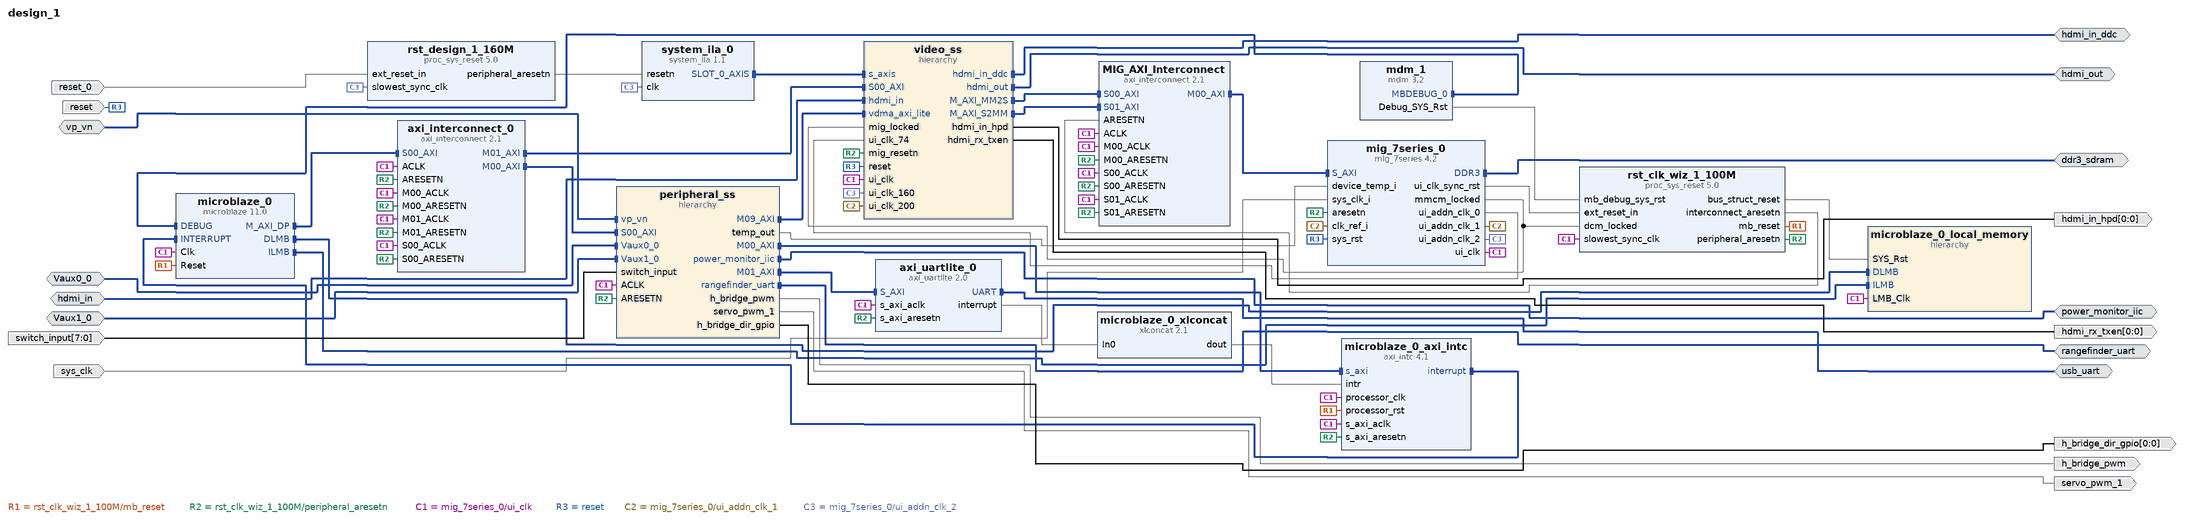
[diagram p0: block diagram of the top level]
# Vivado block design design_1, xc7a200tsbg484-1, Vivado 2018.3
create_bd_design design_1

create_bd_intf_port -mode Master -vlnv xilinx.com:interface:uart_rtl:1.0 usb_uart
create_bd_intf_port -mode Master -vlnv xilinx.com:interface:iic_rtl:1.0 power_monitor_iic
create_bd_intf_port -mode Master -vlnv xilinx.com:interface:uart_rtl:1.0 rangefinder_uart
create_bd_intf_port -mode Slave -vlnv digilentinc.com:interface:tmds_rtl:1.0 hdmi_in
create_bd_intf_port -mode Master -vlnv xilinx.com:interface:iic_rtl:1.0 hdmi_in_ddc
create_bd_intf_port -mode Master -vlnv digilentinc.com:interface:tmds_rtl:1.0 hdmi_out
create_bd_intf_port -mode Slave -vlnv xilinx.com:interface:diff_analog_io_rtl:1.0 vp_vn
create_bd_intf_port -mode Slave -vlnv xilinx.com:interface:diff_analog_io_rtl:1.0 Vaux0_0
create_bd_intf_port -mode Slave -vlnv xilinx.com:interface:diff_analog_io_rtl:1.0 Vaux1_0
create_bd_intf_port -mode Master -vlnv xilinx.com:interface:ddrx_rtl:1.0 ddr3_sdram
create_bd_port -dir O h_bridge_pwm
create_bd_port -dir O servo_pwm_1
create_bd_port -dir O -from 0 -to 0 h_bridge_dir_gpio
create_bd_port -dir I -from 7 -to 0 switch_input
create_bd_port -dir O -from 0 -to 0 hdmi_in_hpd
create_bd_port -dir O -from 0 -to 0 hdmi_rx_txen
create_bd_port -dir I -type rst reset
set_property -dict {CONFIG.POLARITY ACTIVE_LOW} [get_bd_ports reset]
create_bd_port -dir I -type clk sys_clk
create_bd_port -dir I -type rst reset_0
set_property -dict {CONFIG.POLARITY ACTIVE_LOW} [get_bd_ports reset_0]

create_bd_cell -type ip -vlnv xilinx.com:ip:microblaze:11.0 microblaze_0
set_property -dict {CONFIG.C_DEBUG_ENABLED 1 CONFIG.C_D_AXI 1 CONFIG.C_D_LMB 1 CONFIG.C_I_LMB 1} [get_bd_cells microblaze_0]
create_bd_cell -type hier microblaze_0_local_memory
create_bd_cell -type ip -vlnv xilinx.com:ip:axi_intc:4.1 microblaze_0_axi_intc
set_property -dict {CONFIG.C_HAS_FAST 1} [get_bd_cells microblaze_0_axi_intc]
create_bd_cell -type ip -vlnv xilinx.com:ip:xlconcat:2.1 microblaze_0_xlconcat
set_property -dict {CONFIG.NUM_PORTS 1} [get_bd_cells microblaze_0_xlconcat]
create_bd_cell -type ip -vlnv xilinx.com:ip:mdm:3.2 mdm_1
create_bd_cell -type ip -vlnv xilinx.com:ip:proc_sys_reset:5.0 rst_clk_wiz_1_100M
set_property -dict {CONFIG.RESET_BOARD_INTERFACE Custom CONFIG.USE_BOARD_FLOW true} [get_bd_cells rst_clk_wiz_1_100M]
create_bd_cell -type ip -vlnv xilinx.com:ip:axi_uartlite:2.0 axi_uartlite_0
set_property -dict {CONFIG.UARTLITE_BOARD_INTERFACE usb_uart CONFIG.USE_BOARD_FLOW true} [get_bd_cells axi_uartlite_0]
create_bd_cell -type hier video_ss
create_bd_cell -type hier peripheral_ss
create_bd_cell -type ip -vlnv xilinx.com:ip:axi_interconnect:2.1 MIG_AXI_Interconnect
set_property -dict {CONFIG.NUM_MI 1 CONFIG.NUM_SI 2} [get_bd_cells MIG_AXI_Interconnect]
create_bd_cell -type ip -vlnv xilinx.com:ip:mig_7series:4.2 mig_7series_0
set_property -dict [list \
  CONFIG.BOARD_MIG_PARAM ddr3_sdram \
  CONFIG.MIG_DONT_TOUCH_PARAM Custom \
  CONFIG.RESET_BOARD_INTERFACE Custom \
  CONFIG.XML_INPUT_FILE mig_a.prj \
] [get_bd_cells mig_7series_0]
create_bd_cell -type ip -vlnv xilinx.com:ip:axi_interconnect:2.1 axi_interconnect_0
create_bd_cell -type ip -vlnv xilinx.com:ip:system_ila:1.1 system_ila_0
set_property -dict [list \
  CONFIG.C_MON_TYPE INTERFACE \
  CONFIG.C_NUM_MONITOR_SLOTS 1 \
  CONFIG.C_SLOT_0_APC_EN 0 \
  CONFIG.C_SLOT_0_AXI_DATA_SEL 1 \
  CONFIG.C_SLOT_0_AXI_TRIG_SEL 1 \
  CONFIG.C_SLOT_0_INTF_TYPE xilinx.com:interface:axis_rtl:1.0 \
] [get_bd_cells system_ila_0]
create_bd_cell -type ip -vlnv xilinx.com:ip:proc_sys_reset:5.0 rst_design_1_160M
set_property -dict {CONFIG.RESET_BOARD_INTERFACE reset CONFIG.USE_BOARD_FLOW true} [get_bd_cells rst_design_1_160M]

# ---- hierarchy /microblaze_0_local_memory ----
current_bd_instance /microblaze_0_local_memory
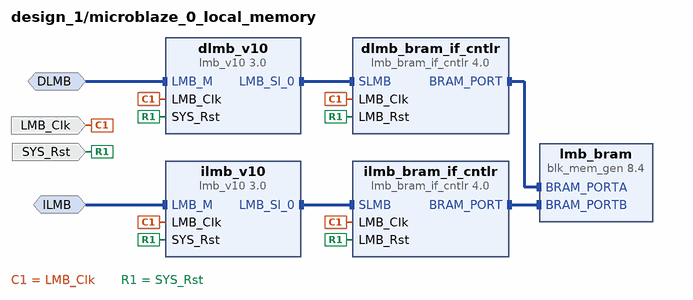
[diagram p1: block diagram inside /microblaze_0_local_memory]
create_bd_intf_pin -mode MirroredMaster -vlnv xilinx.com:interface:lmb_rtl:1.0 DLMB
create_bd_intf_pin -mode MirroredMaster -vlnv xilinx.com:interface:lmb_rtl:1.0 ILMB
create_bd_pin -dir I -type clk LMB_Clk
create_bd_pin -dir I -type rst SYS_Rst

create_bd_cell -type ip -vlnv xilinx.com:ip:lmb_v10:3.0 dlmb_v10
create_bd_cell -type ip -vlnv xilinx.com:ip:lmb_v10:3.0 ilmb_v10
create_bd_cell -type ip -vlnv xilinx.com:ip:lmb_bram_if_cntlr:4.0 dlmb_bram_if_cntlr
set_property -dict {CONFIG.C_ECC 0} [get_bd_cells dlmb_bram_if_cntlr]
create_bd_cell -type ip -vlnv xilinx.com:ip:lmb_bram_if_cntlr:4.0 ilmb_bram_if_cntlr
set_property -dict {CONFIG.C_ECC 0} [get_bd_cells ilmb_bram_if_cntlr]
create_bd_cell -type ip -vlnv xilinx.com:ip:blk_mem_gen:8.4 lmb_bram
set_property -dict {CONFIG.Memory_Type True_Dual_Port_RAM CONFIG.use_bram_block BRAM_Controller} [get_bd_cells lmb_bram]

# ---- hierarchy /video_ss ----
current_bd_instance /video_ss
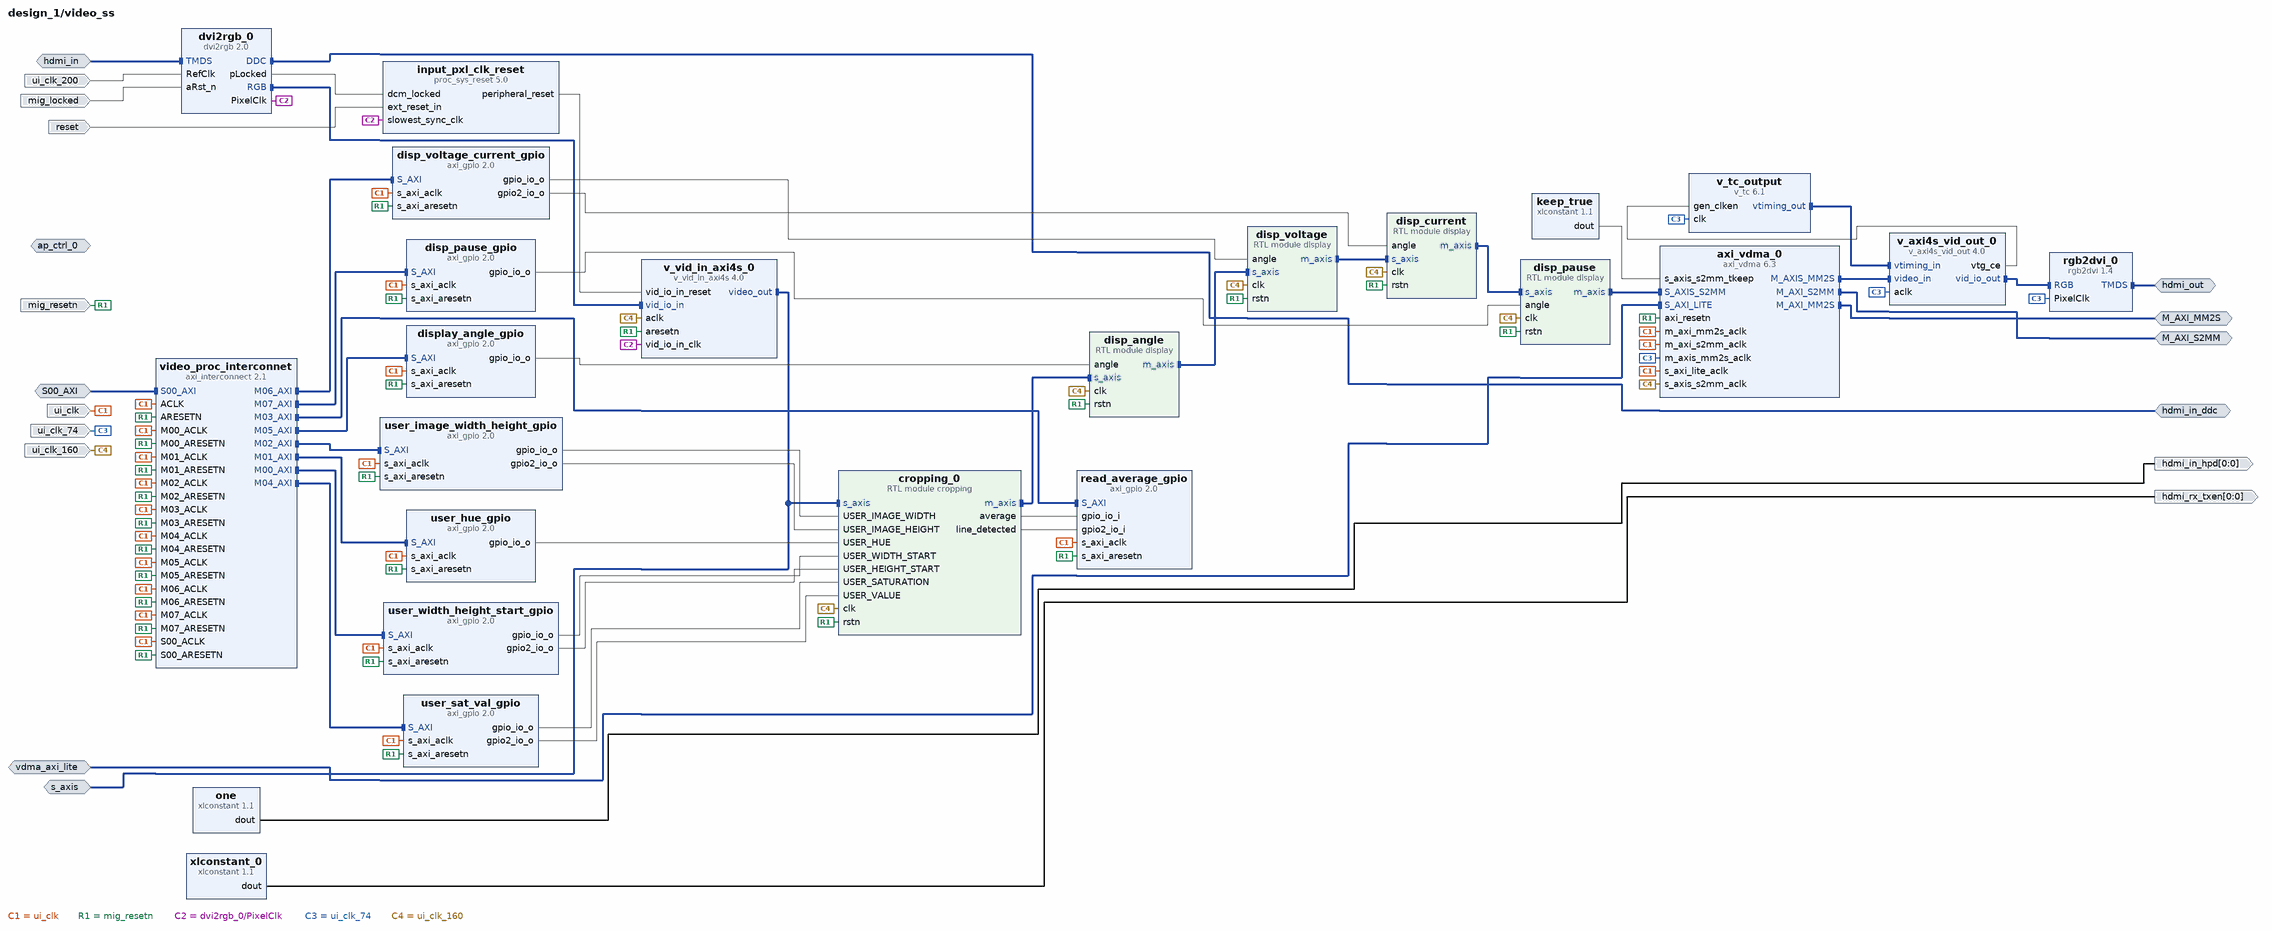
[diagram p2: block diagram inside /video_ss]
create_bd_intf_pin -mode Slave -vlnv digilentinc.com:interface:tmds_rtl:1.0 hdmi_in
create_bd_intf_pin -mode Master -vlnv xilinx.com:interface:iic_rtl:1.0 hdmi_in_ddc
create_bd_intf_pin -mode Master -vlnv digilentinc.com:interface:tmds_rtl:1.0 hdmi_out
create_bd_intf_pin -mode Slave -vlnv xilinx.com:interface:aximm_rtl:1.0 vdma_axi_lite
create_bd_intf_pin -mode Master -vlnv xilinx.com:interface:aximm_rtl:1.0 M_AXI_MM2S
create_bd_intf_pin -mode Master -vlnv xilinx.com:interface:aximm_rtl:1.0 M_AXI_S2MM
create_bd_intf_pin -mode Slave -vlnv xilinx.com:interface:acc_handshake_rtl:1.0 ap_ctrl_0
create_bd_intf_pin -mode Slave -vlnv xilinx.com:interface:aximm_rtl:1.0 S00_AXI
create_bd_intf_pin -mode Monitor -vlnv xilinx.com:interface:axis_rtl:1.0 s_axis
create_bd_pin -dir I -type clk ui_clk_200
create_bd_pin -dir I -type clk ui_clk
create_bd_pin -dir I -type rst mig_resetn
create_bd_pin -dir O -from 0 -to 0 hdmi_in_hpd
create_bd_pin -dir O -from 0 -to 0 hdmi_rx_txen
create_bd_pin -dir I -type clk ui_clk_160
create_bd_pin -dir I -type rst mig_locked
create_bd_pin -dir I -type rst reset
create_bd_pin -dir I -type clk ui_clk_74

create_bd_cell -type ip -vlnv xilinx.com:ip:v_vid_in_axi4s:4.0 v_vid_in_axi4s_0
set_property -dict {CONFIG.C_HAS_ASYNC_CLK 1} [get_bd_cells v_vid_in_axi4s_0]
create_bd_cell -type ip -vlnv digilentinc.com:ip:rgb2dvi:1.4 rgb2dvi_0
set_property -dict {CONFIG.kClkRange 3 CONFIG.kRstActiveHigh false} [get_bd_cells rgb2dvi_0]
create_bd_cell -type ip -vlnv xilinx.com:ip:v_axi4s_vid_out:4.0 v_axi4s_vid_out_0
set_property -dict {CONFIG.C_HAS_ASYNC_CLK 0 CONFIG.C_VTG_MASTER_SLAVE 0} [get_bd_cells v_axi4s_vid_out_0]
create_bd_cell -type ip -vlnv xilinx.com:ip:axi_vdma:6.3 axi_vdma_0
set_property -dict [list \
  CONFIG.c_include_mm2s_dre 1 \
  CONFIG.c_include_s2mm_dre 1 \
  CONFIG.c_m_axis_mm2s_tdata_width 24 \
  CONFIG.c_num_fstores 1 \
] [get_bd_cells axi_vdma_0]
create_bd_cell -type ip -vlnv xilinx.com:ip:xlconstant:1.1 one
create_bd_cell -type ip -vlnv xilinx.com:ip:xlconstant:1.1 xlconstant_0
create_bd_cell -type ip -vlnv xilinx.com:ip:proc_sys_reset:5.0 input_pxl_clk_reset
set_property -dict {CONFIG.RESET_BOARD_INTERFACE reset CONFIG.USE_BOARD_FLOW true} [get_bd_cells input_pxl_clk_reset]
create_bd_cell -type ip -vlnv xilinx.com:ip:v_tc:6.1 v_tc_output
set_property -dict {CONFIG.HAS_AXI4_LITE false CONFIG.VIDEO_MODE 720p CONFIG.enable_detection false} [get_bd_cells v_tc_output]
create_bd_cell -type ip -vlnv xilinx.com:ip:xlconstant:1.1 keep_true
set_property -dict {CONFIG.CONST_VAL 7 CONFIG.CONST_WIDTH 3} [get_bd_cells keep_true]
create_bd_cell -type ip -vlnv xilinx.com:ip:axi_gpio:2.0 user_image_width_height_gpio
set_property -dict [list \
  CONFIG.C_ALL_OUTPUTS 1 \
  CONFIG.C_ALL_OUTPUTS_2 1 \
  CONFIG.C_DOUT_DEFAULT 0x0000005A \
  CONFIG.C_DOUT_DEFAULT_2 0x0000005A \
  CONFIG.C_IS_DUAL 1 \
] [get_bd_cells user_image_width_height_gpio]
create_bd_cell -type ip -vlnv xilinx.com:ip:axi_gpio:2.0 user_width_height_start_gpio
set_property -dict [list \
  CONFIG.C_ALL_OUTPUTS 1 \
  CONFIG.C_ALL_OUTPUTS_2 1 \
  CONFIG.C_DOUT_DEFAULT 0x0000049C \
  CONFIG.C_DOUT_DEFAULT_2 0x0000026C \
  CONFIG.C_IS_DUAL 1 \
] [get_bd_cells user_width_height_start_gpio]
create_bd_cell -type ip -vlnv xilinx.com:ip:axi_gpio:2.0 user_hue_gpio
set_property -dict {CONFIG.C_ALL_OUTPUTS 1 CONFIG.C_DOUT_DEFAULT 0x00000014 CONFIG.C_GPIO_WIDTH 9} [get_bd_cells user_hue_gpio]
create_bd_cell -type ip -vlnv xilinx.com:ip:axi_gpio:2.0 read_average_gpio
set_property -dict [list \
  CONFIG.C_ALL_INPUTS 1 \
  CONFIG.C_ALL_INPUTS_2 1 \
  CONFIG.C_GPIO2_WIDTH 1 \
  CONFIG.C_GPIO_WIDTH 24 \
  CONFIG.C_IS_DUAL 1 \
] [get_bd_cells read_average_gpio]
create_bd_cell -type ip -vlnv xilinx.com:ip:axi_interconnect:2.1 video_proc_interconnet
set_property -dict {CONFIG.NUM_MI 8} [get_bd_cells video_proc_interconnet]
create_bd_cell -type ip -vlnv digilentinc.com:ip:dvi2rgb:2.0 dvi2rgb_0
set_property -dict [list \
  CONFIG.kAddBUFG false \
  CONFIG.kClkRange 3 \
  CONFIG.kEdidFileName dgl_720p_cea.data \
  CONFIG.kRstActiveHigh false \
] [get_bd_cells dvi2rgb_0]
create_bd_cell -type ip -vlnv xilinx.com:ip:axi_gpio:2.0 user_sat_val_gpio
set_property -dict [list \
  CONFIG.C_ALL_OUTPUTS 1 \
  CONFIG.C_ALL_OUTPUTS_2 1 \
  CONFIG.C_DOUT_DEFAULT 0x00000032 \
  CONFIG.C_DOUT_DEFAULT_2 0x00000032 \
  CONFIG.C_GPIO2_WIDTH 8 \
  CONFIG.C_GPIO_WIDTH 8 \
  CONFIG.C_IS_DUAL 1 \
] [get_bd_cells user_sat_val_gpio]
create_bd_cell -type ip -vlnv xilinx.com:ip:axi_gpio:2.0 display_angle_gpio
set_property -dict {CONFIG.C_ALL_OUTPUTS 1 CONFIG.C_GPIO_WIDTH 32} [get_bd_cells display_angle_gpio]
create_bd_cell -type ip -vlnv xilinx.com:ip:axi_gpio:2.0 disp_voltage_current_gpio
set_property -dict {CONFIG.C_ALL_OUTPUTS 1 CONFIG.C_ALL_OUTPUTS_2 1 CONFIG.C_IS_DUAL 1} [get_bd_cells disp_voltage_current_gpio]
create_bd_cell -type ip -vlnv xilinx.com:ip:axi_gpio:2.0 disp_pause_gpio
set_property -dict {CONFIG.C_ALL_INPUTS 0 CONFIG.C_ALL_OUTPUTS 1} [get_bd_cells disp_pause_gpio]
create_bd_cell -type module -reference cropping cropping_0
set_property -dict {CONFIG.IMAGE_HEIGHT 720 CONFIG.IMAGE_WIDTH 1280} [get_bd_cells cropping_0]
create_bd_cell -type module -reference display disp_current
set_property -dict {CONFIG.START_HEIGHT 128 CONFIG.START_WIDTH 0 CONFIG.UNIT current} [get_bd_cells disp_current]
create_bd_cell -type module -reference display disp_voltage
set_property -dict {CONFIG.START_HEIGHT 0 CONFIG.START_WIDTH 0 CONFIG.UNIT voltage} [get_bd_cells disp_voltage]
create_bd_cell -type module -reference display disp_pause
set_property -dict {CONFIG.START_HEIGHT 128 CONFIG.START_WIDTH 6 CONFIG.UNIT stopgo} [get_bd_cells disp_pause]
create_bd_cell -type module -reference display disp_angle
set_property -dict {CONFIG.START_HEIGHT 0 CONFIG.START_WIDTH 6} [get_bd_cells disp_angle]

# ---- hierarchy /peripheral_ss ----
current_bd_instance /peripheral_ss
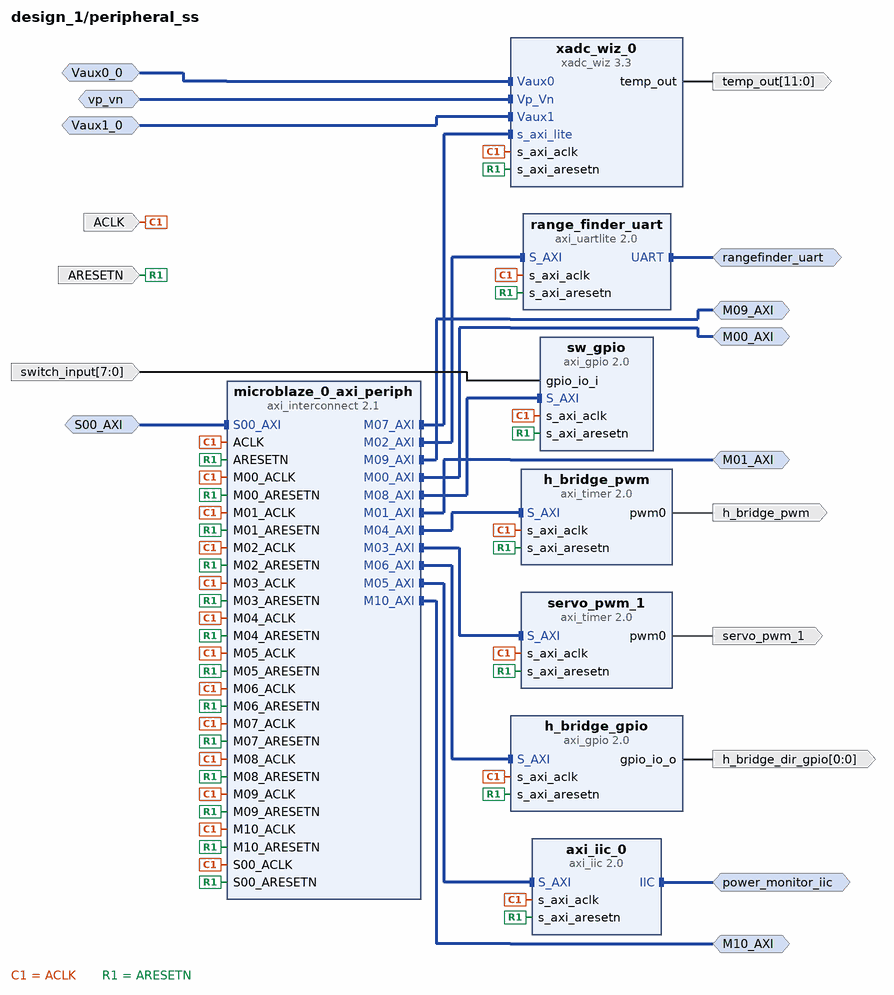
[diagram p3: block diagram inside /peripheral_ss]
create_bd_intf_pin -mode Master -vlnv xilinx.com:interface:iic_rtl:1.0 power_monitor_iic
create_bd_intf_pin -mode Master -vlnv xilinx.com:interface:uart_rtl:1.0 rangefinder_uart
create_bd_intf_pin -mode Slave -vlnv xilinx.com:interface:aximm_rtl:1.0 S00_AXI
create_bd_intf_pin -mode Master -vlnv xilinx.com:interface:aximm_rtl:1.0 M00_AXI
create_bd_intf_pin -mode Master -vlnv xilinx.com:interface:aximm_rtl:1.0 M01_AXI
create_bd_intf_pin -mode Master -vlnv xilinx.com:interface:aximm_rtl:1.0 M09_AXI
create_bd_intf_pin -mode Master -vlnv xilinx.com:interface:aximm_rtl:1.0 M10_AXI
create_bd_intf_pin -mode Slave -vlnv xilinx.com:interface:diff_analog_io_rtl:1.0 vp_vn
create_bd_intf_pin -mode Slave -vlnv xilinx.com:interface:diff_analog_io_rtl:1.0 Vaux0_0
create_bd_intf_pin -mode Slave -vlnv xilinx.com:interface:diff_analog_io_rtl:1.0 Vaux1_0
create_bd_pin -dir O servo_pwm_1
create_bd_pin -dir I -type clk ACLK
create_bd_pin -dir I -type rst ARESETN
create_bd_pin -dir O -from 0 -to 0 h_bridge_dir_gpio
create_bd_pin -dir I -from 7 -to 0 switch_input
create_bd_pin -dir O h_bridge_pwm
create_bd_pin -dir O -from 11 -to 0 temp_out

create_bd_cell -type ip -vlnv xilinx.com:ip:axi_timer:2.0 servo_pwm_1
create_bd_cell -type ip -vlnv xilinx.com:ip:axi_iic:2.0 axi_iic_0
create_bd_cell -type ip -vlnv xilinx.com:ip:axi_gpio:2.0 h_bridge_gpio
set_property -dict {CONFIG.C_ALL_INPUTS 0 CONFIG.C_ALL_OUTPUTS 1 CONFIG.C_GPIO_WIDTH 1} [get_bd_cells h_bridge_gpio]
create_bd_cell -type ip -vlnv xilinx.com:ip:axi_gpio:2.0 sw_gpio
set_property -dict [list \
  CONFIG.C_ALL_INPUTS 1 \
  CONFIG.C_GPIO_WIDTH 8 \
  CONFIG.C_IS_DUAL 0 \
  CONFIG.GPIO_BOARD_INTERFACE Custom \
] [get_bd_cells sw_gpio]
create_bd_cell -type ip -vlnv xilinx.com:ip:axi_uartlite:2.0 range_finder_uart
create_bd_cell -type ip -vlnv xilinx.com:ip:axi_timer:2.0 h_bridge_pwm
create_bd_cell -type ip -vlnv xilinx.com:ip:axi_interconnect:2.1 microblaze_0_axi_periph
set_property -dict {CONFIG.NUM_MI 11} [get_bd_cells microblaze_0_axi_periph]
create_bd_cell -type ip -vlnv xilinx.com:ip:xadc_wiz:3.3 xadc_wiz_0
set_property -dict [list \
  CONFIG.AVERAGE_ENABLE_TEMPERATURE true \
  CONFIG.CHANNEL_AVERAGING 16 \
  CONFIG.CHANNEL_ENABLE_CALIBRATION false \
  CONFIG.CHANNEL_ENABLE_TEMPERATURE true \
  CONFIG.CHANNEL_ENABLE_VAUXP0_VAUXN0 true \
  CONFIG.CHANNEL_ENABLE_VAUXP1_VAUXN1 true \
  CONFIG.CHANNEL_ENABLE_VP_VN true \
  CONFIG.ENABLE_RESET false \
  CONFIG.ENABLE_TEMP_BUS true \
  CONFIG.EXTERNAL_MUX_CHANNEL VP_VN \
  CONFIG.INTERFACE_SELECTION Enable_AXI \
  CONFIG.OT_ALARM false \
  CONFIG.SEQUENCER_MODE Continuous \
  CONFIG.SINGLE_CHANNEL_SELECTION TEMPERATURE \
  CONFIG.USER_TEMP_ALARM false \
  CONFIG.VCCAUX_ALARM false \
  CONFIG.VCCINT_ALARM false \
  CONFIG.XADC_STARUP_SELECTION channel_sequencer \
] [get_bd_cells xadc_wiz_0]

# ---- connections ----

current_bd_instance /microblaze_0_local_memory
connect_bd_intf_net -intf_net microblaze_0_dlmb [get_bd_intf_pins DLMB] [get_bd_intf_pins dlmb_v10/LMB_M]
connect_bd_intf_net -intf_net microblaze_0_ilmb_cntlr [get_bd_intf_pins ilmb_bram_if_cntlr/BRAM_PORT] [get_bd_intf_pins lmb_bram/BRAM_PORTB]
connect_bd_intf_net -intf_net microblaze_0_ilmb_bus [get_bd_intf_pins ilmb_v10/LMB_Sl_0] [get_bd_intf_pins ilmb_bram_if_cntlr/SLMB]
connect_bd_intf_net -intf_net microblaze_0_dlmb_bus [get_bd_intf_pins dlmb_v10/LMB_Sl_0] [get_bd_intf_pins dlmb_bram_if_cntlr/SLMB]
connect_bd_intf_net -intf_net microblaze_0_dlmb_cntlr [get_bd_intf_pins dlmb_bram_if_cntlr/BRAM_PORT] [get_bd_intf_pins lmb_bram/BRAM_PORTA]
connect_bd_intf_net -intf_net microblaze_0_ilmb [get_bd_intf_pins ILMB] [get_bd_intf_pins ilmb_v10/LMB_M]
connect_bd_net -net microblaze_0_Clk [get_bd_pins LMB_Clk] \
  [get_bd_pins dlmb_v10/LMB_Clk] [get_bd_pins dlmb_bram_if_cntlr/LMB_Clk] [get_bd_pins ilmb_v10/LMB_Clk] \
  [get_bd_pins ilmb_bram_if_cntlr/LMB_Clk]
connect_bd_net [get_bd_pins SYS_Rst] \
  [get_bd_pins dlmb_v10/SYS_Rst] [get_bd_pins dlmb_bram_if_cntlr/LMB_Rst] [get_bd_pins ilmb_v10/SYS_Rst] \
  [get_bd_pins ilmb_bram_if_cntlr/LMB_Rst]
set_property HDL_ATTRIBUTE.BMM_INFO_ADDRESS_SPACE {byte  0x00000000 32 > design_1 microblaze_0_local_memory/lmb_bram} [get_bd_cells dlmb_bram_if_cntlr]
set_property HDL_ATTRIBUTE.KEEP_HIERARCHY yes [get_bd_cells dlmb_bram_if_cntlr]

current_bd_instance /video_ss
connect_bd_intf_net [get_bd_intf_pins M_AXI_S2MM] [get_bd_intf_pins axi_vdma_0/M_AXI_S2MM]
connect_bd_intf_net [get_bd_intf_pins S00_AXI] [get_bd_intf_pins video_proc_interconnet/S00_AXI]
connect_bd_intf_net [get_bd_intf_pins M_AXI_MM2S] [get_bd_intf_pins axi_vdma_0/M_AXI_MM2S]
connect_bd_intf_net [get_bd_intf_pins hdmi_in_ddc] [get_bd_intf_pins dvi2rgb_0/DDC]
connect_bd_intf_net [get_bd_intf_pins v_axi4s_vid_out_0/vid_io_out] [get_bd_intf_pins rgb2dvi_0/RGB]
connect_bd_intf_net [get_bd_intf_pins vdma_axi_lite] [get_bd_intf_pins axi_vdma_0/S_AXI_LITE]
connect_bd_intf_net [get_bd_intf_pins v_tc_output/vtiming_out] [get_bd_intf_pins v_axi4s_vid_out_0/vtiming_in]
connect_bd_intf_net [get_bd_intf_pins axi_vdma_0/M_AXIS_MM2S] [get_bd_intf_pins v_axi4s_vid_out_0/video_in]
connect_bd_intf_net [get_bd_intf_pins hdmi_out] [get_bd_intf_pins rgb2dvi_0/TMDS]
connect_bd_intf_net [get_bd_intf_pins user_width_height_start_gpio/S_AXI] [get_bd_intf_pins video_proc_interconnet/M00_AXI]
connect_bd_intf_net [get_bd_intf_pins user_image_width_height_gpio/S_AXI] [get_bd_intf_pins video_proc_interconnet/M02_AXI]
connect_bd_intf_net [get_bd_intf_pins v_vid_in_axi4s_0/vid_io_in] [get_bd_intf_pins dvi2rgb_0/RGB]
connect_bd_intf_net [get_bd_intf_pins disp_angle/m_axis] [get_bd_intf_pins disp_voltage/s_axis]
connect_bd_intf_net [get_bd_intf_pins disp_pause_gpio/S_AXI] [get_bd_intf_pins video_proc_interconnet/M07_AXI]
connect_bd_intf_net -intf_net v_vid_in_axi4s_0_video_out [get_bd_intf_pins cropping_0/s_axis] [get_bd_intf_pins v_vid_in_axi4s_0/video_out]
connect_bd_intf_net [get_bd_intf_pins cropping_0/s_axis] [get_bd_intf_pins s_axis]
connect_bd_intf_net [get_bd_intf_pins disp_voltage/m_axis] [get_bd_intf_pins disp_current/s_axis]
connect_bd_intf_net [get_bd_intf_pins disp_current/m_axis] [get_bd_intf_pins disp_pause/s_axis]
connect_bd_intf_net -intf_net TMDS_0_1 [get_bd_intf_pins hdmi_in] [get_bd_intf_pins dvi2rgb_0/TMDS]
connect_bd_intf_net [get_bd_intf_pins cropping_0/m_axis] [get_bd_intf_pins disp_angle/s_axis]
connect_bd_intf_net [get_bd_intf_pins video_proc_interconnet/M05_AXI] [get_bd_intf_pins display_angle_gpio/S_AXI]
connect_bd_intf_net [get_bd_intf_pins disp_pause/m_axis] [get_bd_intf_pins axi_vdma_0/S_AXIS_S2MM]
connect_bd_intf_net [get_bd_intf_pins read_average_gpio/S_AXI] [get_bd_intf_pins video_proc_interconnet/M03_AXI]
connect_bd_intf_net [get_bd_intf_pins user_hue_gpio/S_AXI] [get_bd_intf_pins video_proc_interconnet/M01_AXI]
connect_bd_intf_net [get_bd_intf_pins user_sat_val_gpio/S_AXI] [get_bd_intf_pins video_proc_interconnet/M04_AXI]
connect_bd_intf_net [get_bd_intf_pins disp_voltage_current_gpio/S_AXI] [get_bd_intf_pins video_proc_interconnet/M06_AXI]
connect_bd_net -net mig_7series_0_ui_addn_clk_0 [get_bd_pins ui_clk_200] [get_bd_pins dvi2rgb_0/RefClk]
connect_bd_net -net microblaze_0_Clk [get_bd_pins ui_clk] \
  [get_bd_pins axi_vdma_0/s_axi_lite_aclk] [get_bd_pins axi_vdma_0/m_axi_mm2s_aclk] [get_bd_pins axi_vdma_0/m_axi_s2mm_aclk] \
  [get_bd_pins video_proc_interconnet/S00_ACLK] [get_bd_pins user_image_width_height_gpio/s_axi_aclk] \
  [get_bd_pins video_proc_interconnet/M02_ACLK] [get_bd_pins user_width_height_start_gpio/s_axi_aclk] \
  [get_bd_pins video_proc_interconnet/M00_ACLK] [get_bd_pins user_hue_gpio/s_axi_aclk] \
  [get_bd_pins video_proc_interconnet/M01_ACLK] [get_bd_pins read_average_gpio/s_axi_aclk] \
  [get_bd_pins video_proc_interconnet/M03_ACLK] [get_bd_pins video_proc_interconnet/ACLK] \
  [get_bd_pins user_sat_val_gpio/s_axi_aclk] [get_bd_pins video_proc_interconnet/M04_ACLK] \
  [get_bd_pins video_proc_interconnet/M05_ACLK] [get_bd_pins display_angle_gpio/s_axi_aclk] \
  [get_bd_pins disp_voltage_current_gpio/s_axi_aclk] [get_bd_pins video_proc_interconnet/M06_ACLK] \
  [get_bd_pins disp_pause_gpio/s_axi_aclk] [get_bd_pins video_proc_interconnet/M07_ACLK]
connect_bd_net -net rst_clk_wiz_1_100M_peripheral_aresetn [get_bd_pins mig_resetn] \
  [get_bd_pins axi_vdma_0/axi_resetn] [get_bd_pins v_vid_in_axi4s_0/aresetn] [get_bd_pins video_proc_interconnet/S00_ARESETN] \
  [get_bd_pins user_image_width_height_gpio/s_axi_aresetn] [get_bd_pins video_proc_interconnet/M02_ARESETN] \
  [get_bd_pins user_width_height_start_gpio/s_axi_aresetn] [get_bd_pins video_proc_interconnet/M00_ARESETN] \
  [get_bd_pins user_hue_gpio/s_axi_aresetn] [get_bd_pins video_proc_interconnet/M01_ARESETN] \
  [get_bd_pins read_average_gpio/s_axi_aresetn] [get_bd_pins video_proc_interconnet/M03_ARESETN] \
  [get_bd_pins video_proc_interconnet/ARESETN] [get_bd_pins user_sat_val_gpio/s_axi_aresetn] \
  [get_bd_pins video_proc_interconnet/M04_ARESETN] [get_bd_pins video_proc_interconnet/M05_ARESETN] \
  [get_bd_pins display_angle_gpio/s_axi_aresetn] [get_bd_pins disp_voltage_current_gpio/s_axi_aresetn] \
  [get_bd_pins video_proc_interconnet/M06_ARESETN] [get_bd_pins disp_pause_gpio/s_axi_aresetn] \
  [get_bd_pins video_proc_interconnet/M07_ARESETN] [get_bd_pins cropping_0/rstn] [get_bd_pins disp_current/rstn] \
  [get_bd_pins disp_voltage/rstn] [get_bd_pins disp_pause/rstn] [get_bd_pins disp_angle/rstn]
connect_bd_net [get_bd_pins one/dout] [get_bd_pins hdmi_in_hpd]
connect_bd_net [get_bd_pins xlconstant_0/dout] [get_bd_pins hdmi_rx_txen]
connect_bd_net [get_bd_pins dvi2rgb_0/PixelClk] [get_bd_pins v_vid_in_axi4s_0/vid_io_in_clk] [get_bd_pins input_pxl_clk_reset/slowest_sync_clk]
connect_bd_net [get_bd_pins dvi2rgb_0/pLocked] [get_bd_pins input_pxl_clk_reset/dcm_locked]
connect_bd_net [get_bd_pins input_pxl_clk_reset/peripheral_reset] [get_bd_pins v_vid_in_axi4s_0/vid_io_in_reset]
connect_bd_net [get_bd_pins v_axi4s_vid_out_0/vtg_ce] [get_bd_pins v_tc_output/gen_clken]
connect_bd_net [get_bd_pins reset] [get_bd_pins input_pxl_clk_reset/ext_reset_in]
connect_bd_net -net PixelClk_1 [get_bd_pins ui_clk_74] \
  [get_bd_pins rgb2dvi_0/PixelClk] [get_bd_pins v_tc_output/clk] [get_bd_pins v_axi4s_vid_out_0/aclk] \
  [get_bd_pins axi_vdma_0/m_axis_mm2s_aclk]
connect_bd_net -net xlconstant_2_dout [get_bd_pins keep_true/dout] [get_bd_pins axi_vdma_0/s_axis_s2mm_tkeep]
connect_bd_net -net aRst_n_1 [get_bd_pins mig_locked] [get_bd_pins dvi2rgb_0/aRst_n]
connect_bd_net -net ui_clk_160_1 [get_bd_pins ui_clk_160] \
  [get_bd_pins v_vid_in_axi4s_0/aclk] [get_bd_pins axi_vdma_0/s_axis_s2mm_aclk] [get_bd_pins cropping_0/clk] \
  [get_bd_pins disp_current/clk] [get_bd_pins disp_voltage/clk] [get_bd_pins disp_pause/clk] [get_bd_pins disp_angle/clk]
connect_bd_net [get_bd_pins user_width_height_start_gpio/gpio_io_o] [get_bd_pins cropping_0/USER_WIDTH_START]
connect_bd_net [get_bd_pins user_width_height_start_gpio/gpio2_io_o] [get_bd_pins cropping_0/USER_HEIGHT_START]
connect_bd_net [get_bd_pins user_image_width_height_gpio/gpio_io_o] [get_bd_pins cropping_0/USER_IMAGE_WIDTH]
connect_bd_net [get_bd_pins user_image_width_height_gpio/gpio2_io_o] [get_bd_pins cropping_0/USER_IMAGE_HEIGHT]
connect_bd_net [get_bd_pins cropping_0/average] [get_bd_pins read_average_gpio/gpio_io_i]
connect_bd_net -net user_threshold_gpio_gpio_io_o [get_bd_pins user_hue_gpio/gpio_io_o] [get_bd_pins cropping_0/USER_HUE]
connect_bd_net [get_bd_pins user_sat_val_gpio/gpio_io_o] [get_bd_pins cropping_0/USER_SATURATION]
connect_bd_net [get_bd_pins user_sat_val_gpio/gpio2_io_o] [get_bd_pins cropping_0/USER_VALUE]
connect_bd_net [get_bd_pins display_angle_gpio/gpio_io_o] [get_bd_pins disp_angle/angle]
connect_bd_net -net disp_voltage_current_gpio2_io_o [get_bd_pins disp_voltage_current_gpio/gpio2_io_o] [get_bd_pins disp_current/angle]
connect_bd_net -net disp_voltage_current_gpio_io_o [get_bd_pins disp_voltage_current_gpio/gpio_io_o] [get_bd_pins disp_voltage/angle]
connect_bd_net [get_bd_pins disp_pause_gpio/gpio_io_o] [get_bd_pins disp_pause/angle]
connect_bd_net [get_bd_pins cropping_0/line_detected] [get_bd_pins read_average_gpio/gpio2_io_i]
set_property HDL_ATTRIBUTE.DEBUG true [get_bd_intf_nets v_vid_in_axi4s_0_video_out]
set_property HDL_ATTRIBUTE.MARK_DEBUG true [get_bd_intf_nets v_vid_in_axi4s_0_video_out]

current_bd_instance /peripheral_ss
connect_bd_intf_net [get_bd_intf_pins M09_AXI] [get_bd_intf_pins microblaze_0_axi_periph/M09_AXI]
connect_bd_intf_net [get_bd_intf_pins power_monitor_iic] [get_bd_intf_pins axi_iic_0/IIC]
connect_bd_intf_net [get_bd_intf_pins microblaze_0_axi_periph/M05_AXI] [get_bd_intf_pins axi_iic_0/S_AXI]
connect_bd_intf_net -intf_net microblaze_0_axi_dp [get_bd_intf_pins S00_AXI] [get_bd_intf_pins microblaze_0_axi_periph/S00_AXI]
connect_bd_intf_net [get_bd_intf_pins M10_AXI] [get_bd_intf_pins microblaze_0_axi_periph/M10_AXI]
connect_bd_intf_net [get_bd_intf_pins Vaux0_0] [get_bd_intf_pins xadc_wiz_0/Vaux0]
connect_bd_intf_net [get_bd_intf_pins microblaze_0_axi_periph/M04_AXI] [get_bd_intf_pins h_bridge_pwm/S_AXI]
connect_bd_intf_net [get_bd_intf_pins M01_AXI] [get_bd_intf_pins microblaze_0_axi_periph/M01_AXI]
connect_bd_intf_net [get_bd_intf_pins vp_vn] [get_bd_intf_pins xadc_wiz_0/Vp_Vn]
connect_bd_intf_net -intf_net microblaze_0_intc_axi [get_bd_intf_pins M00_AXI] [get_bd_intf_pins microblaze_0_axi_periph/M00_AXI]
connect_bd_intf_net [get_bd_intf_pins microblaze_0_axi_periph/M07_AXI] [get_bd_intf_pins xadc_wiz_0/s_axi_lite]
connect_bd_intf_net [get_bd_intf_pins rangefinder_uart] [get_bd_intf_pins range_finder_uart/UART]
connect_bd_intf_net [get_bd_intf_pins Vaux1_0] [get_bd_intf_pins xadc_wiz_0/Vaux1]
connect_bd_intf_net [get_bd_intf_pins microblaze_0_axi_periph/M06_AXI] [get_bd_intf_pins h_bridge_gpio/S_AXI]
connect_bd_intf_net [get_bd_intf_pins microblaze_0_axi_periph/M08_AXI] [get_bd_intf_pins sw_gpio/S_AXI]
connect_bd_intf_net [get_bd_intf_pins microblaze_0_axi_periph/M03_AXI] [get_bd_intf_pins servo_pwm_1/S_AXI]
connect_bd_intf_net [get_bd_intf_pins microblaze_0_axi_periph/M02_AXI] [get_bd_intf_pins range_finder_uart/S_AXI]
connect_bd_net [get_bd_pins servo_pwm_1/pwm0] [get_bd_pins servo_pwm_1]
connect_bd_net -net microblaze_0_Clk [get_bd_pins ACLK] \
  [get_bd_pins microblaze_0_axi_periph/ACLK] [get_bd_pins microblaze_0_axi_periph/S00_ACLK] \
  [get_bd_pins microblaze_0_axi_periph/M00_ACLK] [get_bd_pins microblaze_0_axi_periph/M01_ACLK] \
  [get_bd_pins range_finder_uart/s_axi_aclk] [get_bd_pins microblaze_0_axi_periph/M02_ACLK] \
  [get_bd_pins microblaze_0_axi_periph/M03_ACLK] [get_bd_pins h_bridge_pwm/s_axi_aclk] \
  [get_bd_pins microblaze_0_axi_periph/M04_ACLK] [get_bd_pins axi_iic_0/s_axi_aclk] \
  [get_bd_pins microblaze_0_axi_periph/M05_ACLK] [get_bd_pins h_bridge_gpio/s_axi_aclk] \
  [get_bd_pins microblaze_0_axi_periph/M06_ACLK] [get_bd_pins microblaze_0_axi_periph/M07_ACLK] \
  [get_bd_pins sw_gpio/s_axi_aclk] [get_bd_pins microblaze_0_axi_periph/M08_ACLK] \
  [get_bd_pins microblaze_0_axi_periph/M09_ACLK] [get_bd_pins microblaze_0_axi_periph/M10_ACLK] \
  [get_bd_pins servo_pwm_1/s_axi_aclk] [get_bd_pins xadc_wiz_0/s_axi_aclk]
connect_bd_net -net rst_clk_wiz_1_100M_peripheral_aresetn [get_bd_pins ARESETN] \
  [get_bd_pins microblaze_0_axi_periph/ARESETN] [get_bd_pins microblaze_0_axi_periph/S00_ARESETN] \
  [get_bd_pins microblaze_0_axi_periph/M00_ARESETN] [get_bd_pins microblaze_0_axi_periph/M01_ARESETN] \
  [get_bd_pins range_finder_uart/s_axi_aresetn] [get_bd_pins microblaze_0_axi_periph/M02_ARESETN] \
  [get_bd_pins microblaze_0_axi_periph/M03_ARESETN] [get_bd_pins h_bridge_pwm/s_axi_aresetn] \
  [get_bd_pins microblaze_0_axi_periph/M04_ARESETN] [get_bd_pins axi_iic_0/s_axi_aresetn] \
  [get_bd_pins microblaze_0_axi_periph/M05_ARESETN] [get_bd_pins h_bridge_gpio/s_axi_aresetn] \
  [get_bd_pins microblaze_0_axi_periph/M06_ARESETN] [get_bd_pins microblaze_0_axi_periph/M07_ARESETN] \
  [get_bd_pins sw_gpio/s_axi_aresetn] [get_bd_pins microblaze_0_axi_periph/M08_ARESETN] \
  [get_bd_pins microblaze_0_axi_periph/M09_ARESETN] [get_bd_pins microblaze_0_axi_periph/M10_ARESETN] \
  [get_bd_pins servo_pwm_1/s_axi_aresetn] [get_bd_pins xadc_wiz_0/s_axi_aresetn]
connect_bd_net [get_bd_pins h_bridge_gpio/gpio_io_o] [get_bd_pins h_bridge_dir_gpio]
connect_bd_net -net gpio_io_i_0_1 [get_bd_pins switch_input] [get_bd_pins sw_gpio/gpio_io_i]
connect_bd_net -net h_bridge_pwm [get_bd_pins h_bridge_pwm/pwm0] [get_bd_pins h_bridge_pwm]
connect_bd_net [get_bd_pins xadc_wiz_0/temp_out] [get_bd_pins temp_out]

current_bd_instance /
connect_bd_intf_net -intf_net axi_vdma_0_M_AXI_MM2S [get_bd_intf_pins video_ss/M_AXI_MM2S] [get_bd_intf_pins MIG_AXI_Interconnect/S00_AXI]
connect_bd_intf_net [get_bd_intf_pins mdm_1/MBDEBUG_0] [get_bd_intf_pins microblaze_0/DEBUG]
connect_bd_intf_net [get_bd_intf_pins microblaze_0/DLMB] [get_bd_intf_pins microblaze_0_local_memory/DLMB]
connect_bd_intf_net [get_bd_intf_pins axi_interconnect_0/S00_AXI] [get_bd_intf_pins microblaze_0/M_AXI_DP]
connect_bd_intf_net -intf_net microblaze_0_intc_axi [get_bd_intf_pins peripheral_ss/M00_AXI] [get_bd_intf_pins microblaze_0_axi_intc/s_axi]
connect_bd_intf_net [get_bd_intf_pins peripheral_ss/M09_AXI] [get_bd_intf_pins video_ss/vdma_axi_lite]
connect_bd_intf_net [get_bd_intf_pins microblaze_0/ILMB] [get_bd_intf_pins microblaze_0_local_memory/ILMB]
connect_bd_intf_net -intf_net Vp_Vn_0_1 [get_bd_intf_ports vp_vn] [get_bd_intf_pins peripheral_ss/vp_vn]
connect_bd_intf_net [get_bd_intf_pins video_ss/M_AXI_S2MM] [get_bd_intf_pins MIG_AXI_Interconnect/S01_AXI]
connect_bd_intf_net -intf_net dvi2rgb_0_DDC [get_bd_intf_ports hdmi_in_ddc] [get_bd_intf_pins video_ss/hdmi_in_ddc]
connect_bd_intf_net [get_bd_intf_pins microblaze_0_axi_intc/interrupt] [get_bd_intf_pins microblaze_0/INTERRUPT]
connect_bd_intf_net [get_bd_intf_pins MIG_AXI_Interconnect/M00_AXI] [get_bd_intf_pins mig_7series_0/S_AXI]
connect_bd_intf_net -intf_net axi_iic_0_IIC [get_bd_intf_ports power_monitor_iic] [get_bd_intf_pins peripheral_ss/power_monitor_iic]
connect_bd_intf_net -intf_net TMDS_0_1 [get_bd_intf_ports hdmi_in] [get_bd_intf_pins video_ss/hdmi_in]
connect_bd_intf_net [get_bd_intf_pins axi_interconnect_0/M00_AXI] [get_bd_intf_pins peripheral_ss/S00_AXI]
connect_bd_intf_net -intf_net rgb2dvi_0_TMDS [get_bd_intf_ports hdmi_out] [get_bd_intf_pins video_ss/hdmi_out]
connect_bd_intf_net [get_bd_intf_pins peripheral_ss/M01_AXI] [get_bd_intf_pins axi_uartlite_0/S_AXI]
connect_bd_intf_net [get_bd_intf_pins axi_interconnect_0/M01_AXI] [get_bd_intf_pins video_ss/S00_AXI]
connect_bd_intf_net -intf_net Conn [get_bd_intf_pins system_ila_0/SLOT_0_AXIS] [get_bd_intf_pins video_ss/s_axis]
connect_bd_intf_net [get_bd_intf_ports usb_uart] [get_bd_intf_pins axi_uartlite_0/UART]
connect_bd_intf_net -intf_net Vaux0_0_1 [get_bd_intf_ports Vaux0_0] [get_bd_intf_pins peripheral_ss/Vaux0_0]
connect_bd_intf_net -intf_net Vaux1_0_1 [get_bd_intf_ports Vaux1_0] [get_bd_intf_pins peripheral_ss/Vaux1_0]
connect_bd_intf_net -intf_net range_finder_uart_UART [get_bd_intf_ports rangefinder_uart] [get_bd_intf_pins peripheral_ss/rangefinder_uart]
connect_bd_intf_net [get_bd_intf_ports ddr3_sdram] [get_bd_intf_pins mig_7series_0/DDR3]
connect_bd_net -net microblaze_0_intr [get_bd_pins microblaze_0_xlconcat/dout] [get_bd_pins microblaze_0_axi_intc/intr]
connect_bd_net [get_bd_pins rst_clk_wiz_1_100M/mb_reset] [get_bd_pins microblaze_0/Reset] [get_bd_pins microblaze_0_axi_intc/processor_rst]
connect_bd_net [get_bd_pins rst_clk_wiz_1_100M/bus_struct_reset] [get_bd_pins microblaze_0_local_memory/SYS_Rst]
connect_bd_net [get_bd_pins rst_clk_wiz_1_100M/peripheral_aresetn] \
  [get_bd_pins microblaze_0_axi_intc/s_axi_aresetn] [get_bd_pins axi_uartlite_0/s_axi_aresetn] \
  [get_bd_pins video_ss/mig_resetn] [get_bd_pins peripheral_ss/ARESETN] [get_bd_pins MIG_AXI_Interconnect/S00_ARESETN] \
  [get_bd_pins MIG_AXI_Interconnect/M00_ARESETN] [get_bd_pins MIG_AXI_Interconnect/S01_ARESETN] \
  [get_bd_pins mig_7series_0/aresetn] [get_bd_pins axi_interconnect_0/ARESETN] [get_bd_pins axi_interconnect_0/S00_ARESETN] \
  [get_bd_pins axi_interconnect_0/M00_ARESETN] [get_bd_pins axi_interconnect_0/M01_ARESETN]
connect_bd_net [get_bd_pins mdm_1/Debug_SYS_Rst] [get_bd_pins rst_clk_wiz_1_100M/mb_debug_sys_rst]
connect_bd_net [get_bd_pins axi_uartlite_0/interrupt] [get_bd_pins microblaze_0_xlconcat/In0]
connect_bd_net -net h_bridge_pwm [get_bd_pins peripheral_ss/h_bridge_pwm] [get_bd_ports h_bridge_pwm]
connect_bd_net -net servo_pwm_1_pwm0 [get_bd_pins peripheral_ss/servo_pwm_1] [get_bd_ports servo_pwm_1]
connect_bd_net -net h_bridge_gpio_gpio_io_o [get_bd_pins peripheral_ss/h_bridge_dir_gpio] [get_bd_ports h_bridge_dir_gpio]
connect_bd_net -net gpio_io_i_0_1 [get_bd_ports switch_input] [get_bd_pins peripheral_ss/switch_input]
connect_bd_net [get_bd_pins video_ss/hdmi_in_hpd] [get_bd_ports hdmi_in_hpd]
connect_bd_net [get_bd_pins video_ss/hdmi_rx_txen] [get_bd_ports hdmi_rx_txen]
connect_bd_net -net microblaze_0_Clk [get_bd_pins mig_7series_0/ui_clk] \
  [get_bd_pins microblaze_0/Clk] [get_bd_pins microblaze_0_axi_intc/s_axi_aclk] \
  [get_bd_pins microblaze_0_axi_intc/processor_clk] [get_bd_pins microblaze_0_local_memory/LMB_Clk] \
  [get_bd_pins rst_clk_wiz_1_100M/slowest_sync_clk] [get_bd_pins axi_uartlite_0/s_axi_aclk] [get_bd_pins video_ss/ui_clk] \
  [get_bd_pins peripheral_ss/ACLK] [get_bd_pins MIG_AXI_Interconnect/ACLK] [get_bd_pins MIG_AXI_Interconnect/S00_ACLK] \
  [get_bd_pins MIG_AXI_Interconnect/S01_ACLK] [get_bd_pins MIG_AXI_Interconnect/M00_ACLK] \
  [get_bd_pins axi_interconnect_0/ACLK] [get_bd_pins axi_interconnect_0/S00_ACLK] [get_bd_pins axi_interconnect_0/M00_ACLK] \
  [get_bd_pins axi_interconnect_0/M01_ACLK]
connect_bd_net [get_bd_pins mig_7series_0/mmcm_locked] [get_bd_pins video_ss/mig_locked] [get_bd_pins rst_clk_wiz_1_100M/dcm_locked]
connect_bd_net -net ARESETN_1 [get_bd_pins rst_clk_wiz_1_100M/interconnect_aresetn] [get_bd_pins MIG_AXI_Interconnect/ARESETN]
connect_bd_net [get_bd_ports reset] [get_bd_pins video_ss/reset] [get_bd_pins mig_7series_0/sys_rst]
connect_bd_net [get_bd_pins peripheral_ss/temp_out] [get_bd_pins mig_7series_0/device_temp_i]
connect_bd_net -net ui_clk_200_1 [get_bd_pins mig_7series_0/ui_addn_clk_1] [get_bd_pins video_ss/ui_clk_200] [get_bd_pins mig_7series_0/clk_ref_i]
connect_bd_net [get_bd_pins mig_7series_0/ui_clk_sync_rst] [get_bd_pins rst_clk_wiz_1_100M/ext_reset_in]
connect_bd_net [get_bd_pins mig_7series_0/ui_addn_clk_0] [get_bd_pins video_ss/ui_clk_74]
connect_bd_net -net ui_clk_160_1 [get_bd_pins mig_7series_0/ui_addn_clk_2] \
  [get_bd_pins video_ss/ui_clk_160] [get_bd_pins system_ila_0/clk] [get_bd_pins rst_design_1_160M/slowest_sync_clk]
connect_bd_net [get_bd_ports sys_clk] [get_bd_pins mig_7series_0/sys_clk_i]
connect_bd_net [get_bd_pins rst_design_1_160M/peripheral_aresetn] [get_bd_pins system_ila_0/resetn]
connect_bd_net -net reset_0_1 [get_bd_ports reset_0] [get_bd_pins rst_design_1_160M/ext_reset_in]
set_property HDL_ATTRIBUTE.BMM_INFO_PROCESSOR {microblaze-le > design_1 microblaze_0_local_memory/dlmb_bram_if_cntlr} [get_bd_cells microblaze_0]
set_property HDL_ATTRIBUTE.KEEP_HIERARCHY yes [get_bd_cells microblaze_0]
set_property HDL_ATTRIBUTE.DEBUG true [get_bd_intf_nets Conn]

# ---- address map ----
assign_bd_address -offset 0x00000000 -range 64K -target_address_space [get_bd_addr_spaces microblaze_0/Data] [get_bd_addr_segs microblaze_0_local_memory/dlmb_bram_if_cntlr/SLMB/Mem]
assign_bd_address -offset 0x40000000 -range 64K -target_address_space [get_bd_addr_spaces microblaze_0/Data] [get_bd_addr_segs peripheral_ss/h_bridge_gpio/S_AXI/Reg]
assign_bd_address -offset 0x40010000 -range 64K -target_address_space [get_bd_addr_spaces microblaze_0/Data] [get_bd_addr_segs peripheral_ss/sw_gpio/S_AXI/Reg]
assign_bd_address -offset 0x40020000 -range 64K -target_address_space [get_bd_addr_spaces microblaze_0/Data] [get_bd_addr_segs video_ss/read_average_gpio/S_AXI/Reg]
assign_bd_address -offset 0x40030000 -range 64K -target_address_space [get_bd_addr_spaces microblaze_0/Data] [get_bd_addr_segs video_ss/user_image_width_height_gpio/S_AXI/Reg]
assign_bd_address -offset 0x40040000 -range 64K -target_address_space [get_bd_addr_spaces microblaze_0/Data] [get_bd_addr_segs video_ss/user_hue_gpio/S_AXI/Reg]
assign_bd_address -offset 0x40050000 -range 64K -target_address_space [get_bd_addr_spaces microblaze_0/Data] [get_bd_addr_segs video_ss/user_width_height_start_gpio/S_AXI/Reg]
assign_bd_address -offset 0x40060000 -range 64K -target_address_space [get_bd_addr_spaces microblaze_0/Data] [get_bd_addr_segs video_ss/user_sat_val_gpio/S_AXI/Reg]
assign_bd_address -offset 0x40070000 -range 64K -target_address_space [get_bd_addr_spaces microblaze_0/Data] [get_bd_addr_segs video_ss/display_angle_gpio/S_AXI/Reg]
assign_bd_address -offset 0x40080000 -range 64K -target_address_space [get_bd_addr_spaces microblaze_0/Data] [get_bd_addr_segs video_ss/disp_voltage_current_gpio/S_AXI/Reg]
assign_bd_address -offset 0x40090000 -range 64K -target_address_space [get_bd_addr_spaces microblaze_0/Data] [get_bd_addr_segs video_ss/disp_pause_gpio/S_AXI/Reg]
assign_bd_address -offset 0x40600000 -range 64K -target_address_space [get_bd_addr_spaces microblaze_0/Data] [get_bd_addr_segs axi_uartlite_0/S_AXI/Reg]
assign_bd_address -offset 0x40610000 -range 64K -target_address_space [get_bd_addr_spaces microblaze_0/Data] [get_bd_addr_segs peripheral_ss/range_finder_uart/S_AXI/Reg]
assign_bd_address -offset 0x40800000 -range 64K -target_address_space [get_bd_addr_spaces microblaze_0/Data] [get_bd_addr_segs peripheral_ss/axi_iic_0/S_AXI/Reg]
assign_bd_address -offset 0x41200000 -range 64K -target_address_space [get_bd_addr_spaces microblaze_0/Data] [get_bd_addr_segs microblaze_0_axi_intc/S_AXI/Reg]
assign_bd_address -offset 0x41C00000 -range 64K -target_address_space [get_bd_addr_spaces microblaze_0/Data] [get_bd_addr_segs peripheral_ss/servo_pwm_1/S_AXI/Reg]
assign_bd_address -offset 0x41C10000 -range 64K -target_address_space [get_bd_addr_spaces microblaze_0/Data] [get_bd_addr_segs peripheral_ss/h_bridge_pwm/S_AXI/Reg]
assign_bd_address -offset 0x44A00000 -range 64K -target_address_space [get_bd_addr_spaces microblaze_0/Data] [get_bd_addr_segs peripheral_ss/xadc_wiz_0/s_axi_lite/Reg]
assign_bd_address -offset 0x44A10000 -range 64K -target_address_space [get_bd_addr_spaces microblaze_0/Data] [get_bd_addr_segs video_ss/axi_vdma_0/S_AXI_LITE/Reg]
assign_bd_address -offset 0x00000000 -range 64K -target_address_space [get_bd_addr_spaces microblaze_0/Instruction] [get_bd_addr_segs microblaze_0_local_memory/ilmb_bram_if_cntlr/SLMB/Mem]
assign_bd_address -offset 0x80000000 -range 512M -target_address_space [get_bd_addr_spaces video_ss/axi_vdma_0/Data_MM2S] [get_bd_addr_segs mig_7series_0/memmap/memaddr]
assign_bd_address -offset 0x80000000 -range 512M -target_address_space [get_bd_addr_spaces video_ss/axi_vdma_0/Data_S2MM] [get_bd_addr_segs mig_7series_0/memmap/memaddr]

validate_bd_design
save_bd_design
